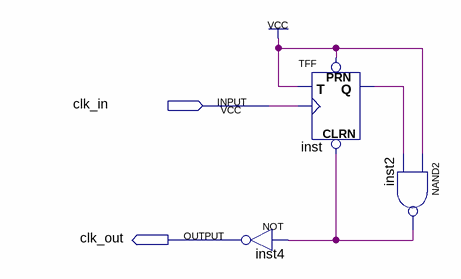
[diagram p0: schematic sheet]
// Quartus schematic pulso.bdf as structural Verilog: 3 symbols, 2 pins
module pulso (
  input  clk_in,
  output clk_out
);

  wire inst2_out, inst_q;

  not inst4 (clk_out, inst2_out);
  TFF inst (.PRN(1'b1), .CLRN(inst2_out), .T(1'b1), .CLK(clk_in), .Q(inst_q));
  nand inst2 (inst2_out, 1'b1, inst_q);
endmodule
